# Altium schematic sheet ct_interface.SchDoc
size A; SheetNumber: 1; SheetTotal: 8
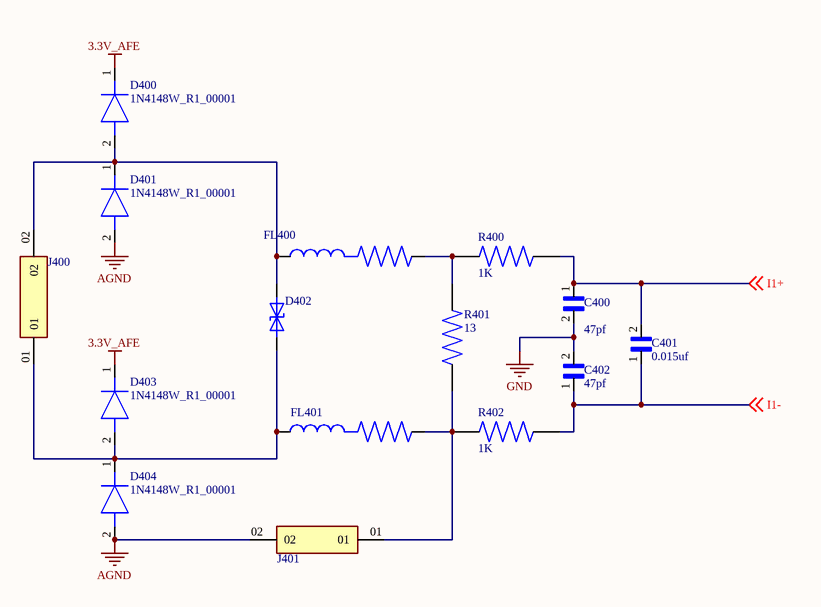
[diagram p0: ct_interface.SchDoc]

## Parts
C400  value 47pf  [CAPC1608X90]  (hidden comment: CC0603JRNPO9BN470)
C401  value 0.015uf  [CAPC1608X87N]  (hidden comment: VJ0603Y153KXAPW1BC)
C402  value 47pf  [CAPC1608X90]  (hidden comment: CC0603JRNPO9BN470)
D400  1N4148W_R1_00001  [SOD3816X135N]
D401  1N4148W_R1_00001  [SOD3816X135N]
D402  SMAJ5.0CA-13-F  [DIOM5126X229N]  (value not drawn)
D403  1N4148W_R1_00001  [SOD3816X135N]
D404  1N4148W_R1_00001  [SOD3816X135N]
FL400  BLM21BD121SN1D  [BEADC2012X105N]  (value not drawn)
FL401  BLM21BD121SN1D  [BEADC2012X105N]  (value not drawn)
J400  MTMM-101-10-G-D-135  [SAMTEC_MTMM-101-10-G-D-135]  (value not drawn)
J401  MTMM-101-10-G-D-135  [SAMTEC_MTMM-101-10-G-D-135]  (value not drawn)
R400  value 1K  [RESC1608X55 - duplicate]  (hidden comment: CR0603-FX-1001ELF)
R401  value 13  [RESC1608X55N - duplicate]  (hidden comment: CR0603-FX-1001ELF)
R402  value 1K  [RESC1608X55N - duplicate]  (hidden comment: CR0603-FX-1001ELF)

## Nets
3.3V_AFE: D400.1(K) D403.1(K)
AGND: D401.2(A) D404.2(A) J401.02
GND: C400.2 C402.2
I1+: C400.1 C401.2 R400.1 ; off-sheet I1+
I1-: C401.1 C402.1 R402.1 ; off-sheet I1-
NetD400_2: D400.2(A) D401.1(K) D402.1 FL400.1 J400.02
NetD402_2: D402.2 D403.2(A) D404.1(K) FL401.1 J400.01
NetFL400_2: FL400.2 R400.2 R401.2
NetFL401_2: FL401.2 J401.01 R401.1 R402.2

## Library data of the parts
C400 C402 = CC0603JRNPO9BN470: CAP CER 47PF 50V C0G/NPO 0603; MF: {'manufacturer': u'Yageo'}; MP: CC0603JRNPO9BN470; Package: None; Price: None; Availability: Unavailable
C401 = VJ0603Y153KXAPW1BC: VJ_W1BC; MF: {'manufacturer': u'Vishay Vitramon'}; MP: VJ0603Y153KXAPW1BC; Availability: Unavailable; Package: None; Price: None
D400 D401 D403 D404 = 1N4148W_R1_00001: Diode; Manufacturer_Name: PANJIT; Datasheet Link: https://www.mouser.com/datasheet/2/1057/1N4148W-1869619.pdf; Height: 1.35mm; Manufacturer_Part_Number: 1N4148W_R1_00001; Mouser Part Number: 241-1N4148W_R1_00001; Mouser Price/Stock: https://www.mouser.co.uk/ProductDetail/Panjit/1N4148W_R1_00001?qs=sPbYRqrBIVnqVztCqPNVrw%3D%3D
D402 = SMAJ5.0CA-13-F: 9.2V Clamp 43.5A Ipp Tvs Diode Surface Mount SMA (DO-214AC); MF: {'manufacturer': u'Diodes Inc.'}; Availability: Unavailable; MP: SMAJ5.0CA-13-F; Price: None; Package: None; Value: *
FL400 FL401 = BLM21BD121SN1D: Ferrite: bead; 120Î©; Mounting: SMD; 200mA; -55Ã·125Â°C; MF: {'manufacturer': u'Murata Electronics'}; MP: BLM21BD121SN1D; Value: *; Package: None; Price: None; Availability: Unavailable
J400 J401 = MTMM-101-10-G-D-135: MF: {'manufacturer': u'Samtec'}; Package: None; Price: None; Value: *; MP: MTMM-101-10-G-D-135; Availability: Unavailable
R400-R402 = CR0603-FX-1001ELF: Resistor; Thick Film; Res 1 Kilohms; Pwr-Rtg 0.1 W; Tol 1%; SMT; 0603; MF: {'manufacturer': u'Bourns'}; Availability: Unavailable; MP: CR0603-FX-1001ELF; Price: None; Package: None